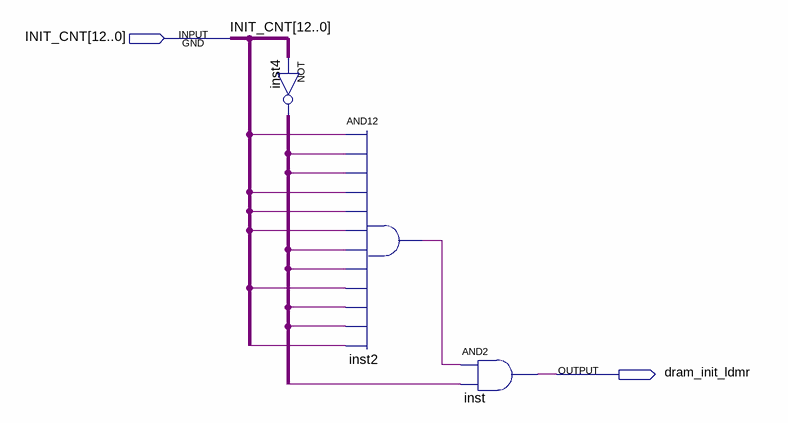
[diagram p0: schematic sheet]
// Quartus schematic dram_init_ldmr.bdf as structural Verilog: 3 symbols, 2 pins
module dram_init_ldmr (
  input  [12:0] INIT_CNT,
  output dram_init_ldmr
);

  wire inst2_out;
  wire [12:0] nINIT_CNT;

  assign nINIT_CNT = ~INIT_CNT;  // NOT inst4, 13 bits wide
  and inst2 (inst2_out, INIT_CNT[12], nINIT_CNT[11], nINIT_CNT[10], INIT_CNT[9], INIT_CNT[8], INIT_CNT[7], nINIT_CNT[6], nINIT_CNT[5], INIT_CNT[4], nINIT_CNT[3], nINIT_CNT[2], INIT_CNT[1]);
  and inst (dram_init_ldmr, inst2_out, nINIT_CNT[0]);
endmodule
